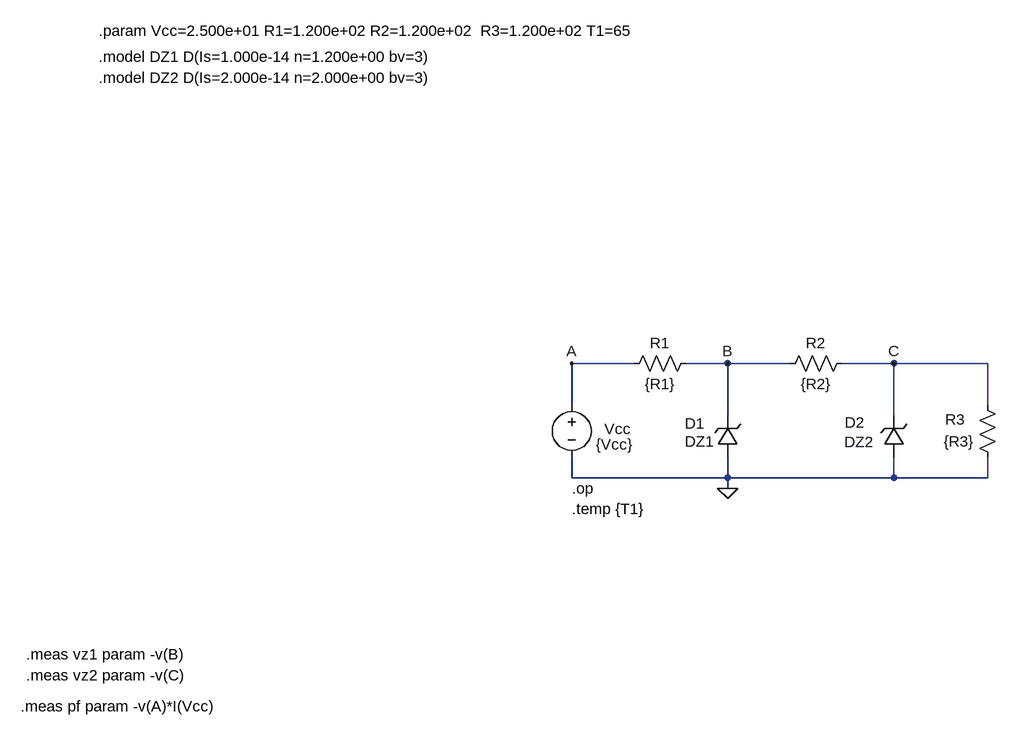
[diagram p0: schematic COMB03op.asc]
COMB03op.asc, the LTspice schematic file:
Version 4
SHEET 1 1624 1076
WIRE 912 -96 816 -96
WIRE 1056 -96 992 -96
WIRE 1152 -96 1056 -96
WIRE 1312 -96 1232 -96
WIRE 1456 -96 1312 -96
WIRE 816 -32 816 -96
WIRE 1456 -32 1456 -96
WIRE 1056 -16 1056 -96
WIRE 1312 -16 1312 -96
WIRE 816 80 816 48
WIRE 1056 80 1056 48
WIRE 1056 80 816 80
WIRE 1312 80 1312 48
WIRE 1312 80 1056 80
WIRE 1456 80 1456 48
WIRE 1456 80 1312 80
WIRE 1056 96 1056 80
FLAG 1056 96 0
FLAG 816 -96 A
FLAG 1056 -96 B
FLAG 1312 -96 C
SYMBOL voltage 816 -48 R0
WINDOW 123 0 0 Left 0
WINDOW 39 0 0 Left 0
WINDOW 0 50 53 Left 2
WINDOW 3 37 77 Left 2
SYMATTR InstName Vcc
SYMATTR Value {Vcc}
SYMBOL res 1008 -112 R90
WINDOW 0 0 56 VBottom 2
WINDOW 3 32 56 VTop 2
SYMATTR InstName R1
SYMATTR Value {R1}
SYMBOL res 1248 -112 R90
WINDOW 0 0 56 VBottom 2
WINDOW 3 32 56 VTop 2
SYMATTR InstName R2
SYMATTR Value {R2}
SYMBOL zener 1072 48 R180
WINDOW 0 51 52 Left 2
WINDOW 3 36 24 Left 2
SYMATTR InstName D1
SYMATTR Value DZ1
SYMBOL zener 1328 48 R180
WINDOW 0 61 53 Left 2
WINDOW 3 47 23 Left 2
SYMATTR InstName D2
SYMATTR Value DZ2
SYMBOL res 1472 64 R180
WINDOW 0 50 74 Left 2
WINDOW 3 36 40 Left 2
SYMATTR InstName R3
SYMATTR Value {R3}
TEXT 816 96 Left 2 !.op
TEXT 88 -608 Left 2 !.param Vcc=2.500e+01 R1=1.200e+02 R2=1.200e+02  R3=1.200e+02 T1=65
TEXT 88 -568 Left 2 !.model DZ1 D(Is=1.000e-14 n=1.200e+00 bv=3)
TEXT 88 -536 Left 2 !.model DZ2 D(Is=2.000e-14 n=2.000e+00 bv=3)
TEXT -24 352 Left 2 !.meas vz1 param -v(B)
TEXT -24 384 Left 2 !.meas vz2 param -v(C)
TEXT 816 128 Left 2 !.temp {T1}
TEXT -32 432 Left 2 !.meas pf param -v(A)*I(Vcc)

The netlist it stands for:
* COMB03op.asc
Vcc A 0 {Vcc}
R1 B A {R1}
R2 C B {R2}
D1 0 B DZ1
D2 0 C DZ2
R3 0 C {R3}
.model D D
.lib standard.dio
.op
.param Vcc=2.500e+01 R1=1.200e+02 R2=1.200e+02  R3=1.200e+02 T1=65
.model DZ1 D(Is=1.000e-14 n=1.200e+00 bv=3)
.model DZ2 D(Is=2.000e-14 n=2.000e+00 bv=3)
.meas vz1 param -v(B)
.meas vz2 param -v(C)
.temp {T1}
.meas pf param -v(A)*I(Vcc)
.backanno
.end